# Altium project Chess Clock Front Display.PrjPcb
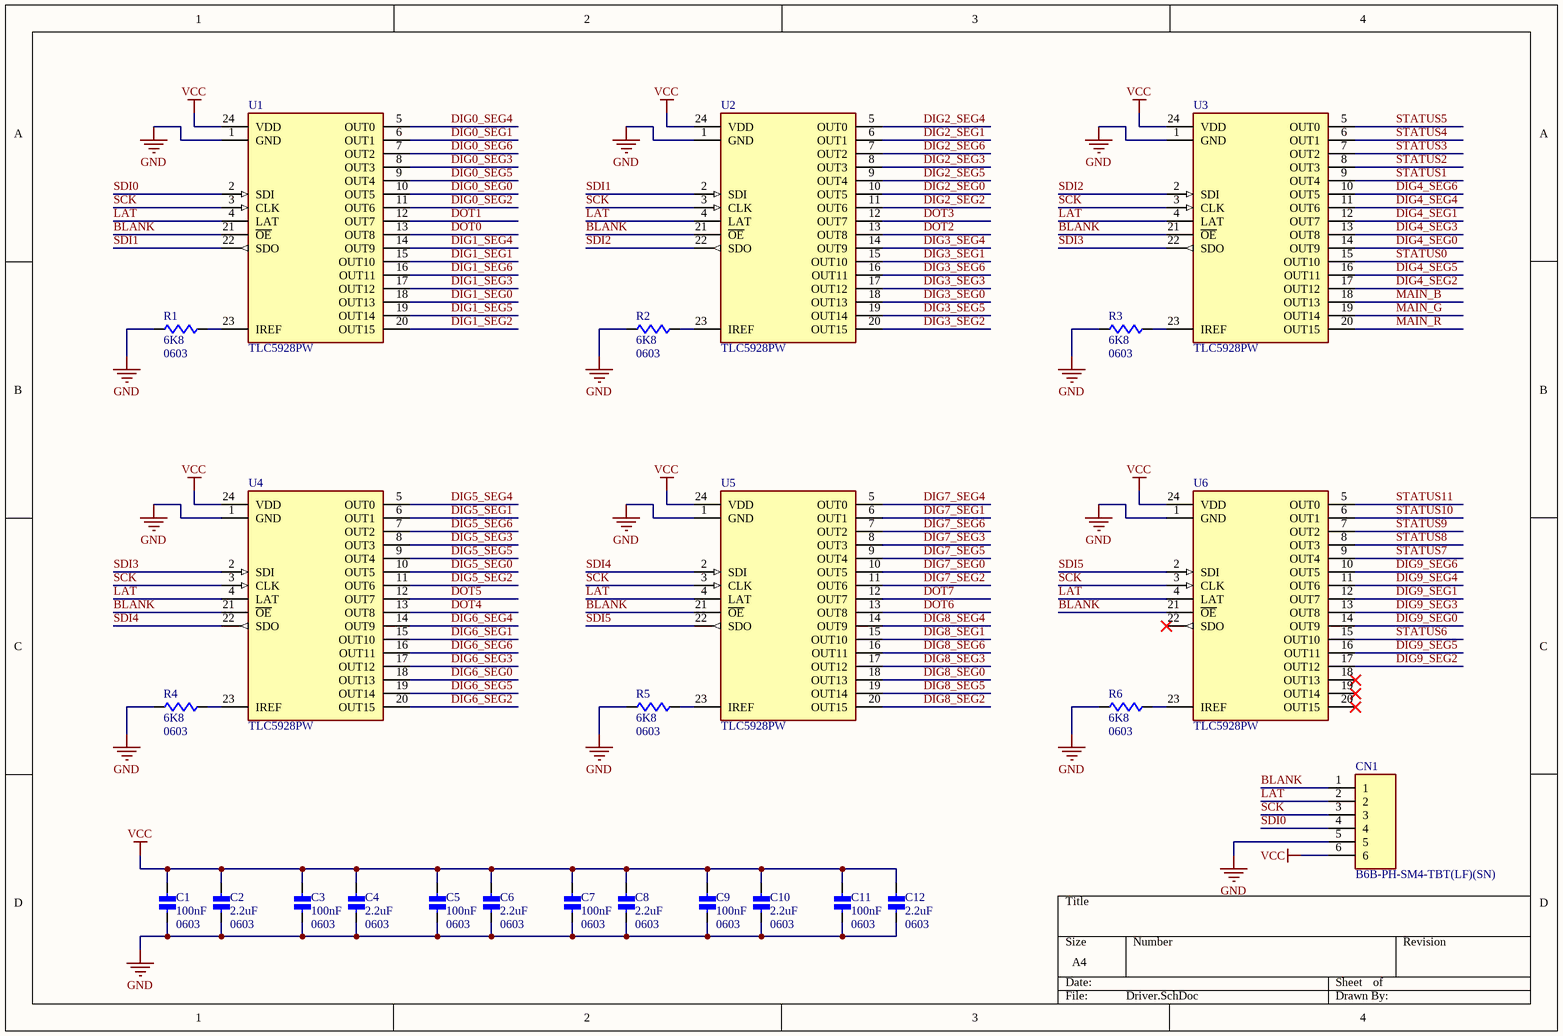
[diagram p0: Driver.SchDoc]
2 sheets, 118 parts. Net scope: global (net labels, ports and power ports of the same name join across sheets).
Board file: Chess Clock Front Display PCB.PcbDoc
Sheets:
  Driver.SchDoc
  Chess Clock Front Display SCH.SchDoc

## Sheet Driver.SchDoc
size A4

### Parts
C1  100nF  Package: 0603  [CAPC0603X08N]
C2  2.2uF  Package: 0603  [CAPC0603X08N]
C3  100nF  Package: 0603  [CAPC0603X08N]
C4  2.2uF  Package: 0603  [CAPC0603X08N]
C5  100nF  Package: 0603  [CAPC0603X08N]
C6  2.2uF  Package: 0603  [CAPC0603X08N]
C7  100nF  Package: 0603  [CAPC0603X08N]
C8  2.2uF  Package: 0603  [CAPC0603X08N]
C9  100nF  Package: 0603  [CAPC0603X08N]
C10  2.2uF  Package: 0603  [CAPC0603X08N]
C11  100nF  Package: 0603  [CAPC0603X08N]
C12  2.2uF  Package: 0603  [CAPC0603X08N]
CN1  B6B-PH-SM4-TBT(LF)(SN)  [B6B-PH-SM4-TBT(LF)(SN)]
R1  6K8  Package: 0603  [RESC0603X04N]
R2  6K8  Package: 0603  [RESC0603X04N]
R3  6K8  Package: 0603  [RESC0603X04N]
R4  6K8  Package: 0603  [RESC0603X04N]
R5  6K8  Package: 0603  [RESC0603X04N]
R6  6K8  Package: 0603  [RESC0603X04N]
U1  TLC5928PW  [TSOP65P640X120-24N]
U2  TLC5928PW  [TSOP65P640X120-24N]
U3  TLC5928PW  [TSOP65P640X120-24N]
U4  TLC5928PW  [TSOP65P640X120-24N]
U5  TLC5928PW  [TSOP65P640X120-24N]
U6  TLC5928PW  [TSOP65P640X120-24N]

### Nets
GND: C1.2 C2.2 C3.2 C4.2 C5.2 C6.2 C7.2 C8.2 C9.2 C10.2 C11.2 C12.2 CN1.5 R1.2 R2.2 R3.2 R4.2 R5.2 R6.2 U1.1(GND) U2.1(GND) U3.1(GND) U4.1(GND) U5.1(GND) U6.1(GND)
VCC: C1.1 C2.1 C3.1 C4.1 C5.1 C6.1 C7.1 C8.1 C9.1 C10.1 C11.1 C12.1 CN1.6 U1.24(VDD) U2.24(VDD) U3.24(VDD) U4.24(VDD) U5.24(VDD) U6.24(VDD)
BLANK: CN1.1 U1.21(~{OE}) U2.21(~{OE}) U3.21(~{OE}) U4.21(~{OE}) U5.21(~{OE}) U6.21(~{OE})
DIG0_SEG0: U1.10(OUT5)
DIG0_SEG1: U1.6(OUT1)
DIG0_SEG2: U1.11(OUT6)
DIG0_SEG3: U1.8(OUT3)
DIG0_SEG4: U1.5(OUT0)
DIG0_SEG5: U1.9(OUT4)
DIG0_SEG6: U1.7(OUT2)
DIG1_SEG0: U1.18(OUT13)
DIG1_SEG1: U1.15(OUT10)
DIG1_SEG2: U1.20(OUT15)
DIG1_SEG3: U1.17(OUT12)
DIG1_SEG4: U1.14(OUT9)
DIG1_SEG5: U1.19(OUT14)
DIG1_SEG6: U1.16(OUT11)
DIG2_SEG0: U2.10(OUT5)
DIG2_SEG1: U2.6(OUT1)
DIG2_SEG2: U2.11(OUT6)
DIG2_SEG3: U2.8(OUT3)
DIG2_SEG4: U2.5(OUT0)
DIG2_SEG5: U2.9(OUT4)
DIG2_SEG6: U2.7(OUT2)
DIG3_SEG0: U2.18(OUT13)
DIG3_SEG1: U2.15(OUT10)
DIG3_SEG2: U2.20(OUT15)
DIG3_SEG3: U2.17(OUT12)
DIG3_SEG4: U2.14(OUT9)
DIG3_SEG5: U2.19(OUT14)
DIG3_SEG6: U2.16(OUT11)
DIG4_SEG0: U3.14(OUT9)
DIG4_SEG1: U3.12(OUT7)
DIG4_SEG2: U3.17(OUT12)
DIG4_SEG3: U3.13(OUT8)
DIG4_SEG4: U3.11(OUT6)
DIG4_SEG5: U3.16(OUT11)
DIG4_SEG6: U3.10(OUT5)
DIG5_SEG0: U4.10(OUT5)
DIG5_SEG1: U4.6(OUT1)
DIG5_SEG2: U4.11(OUT6)
DIG5_SEG3: U4.8(OUT3)
DIG5_SEG4: U4.5(OUT0)
DIG5_SEG5: U4.9(OUT4)
DIG5_SEG6: U4.7(OUT2)
DIG6_SEG0: U4.18(OUT13)
DIG6_SEG1: U4.15(OUT10)
DIG6_SEG2: U4.20(OUT15)
DIG6_SEG3: U4.17(OUT12)
DIG6_SEG4: U4.14(OUT9)
DIG6_SEG5: U4.19(OUT14)
DIG6_SEG6: U4.16(OUT11)
DIG7_SEG0: U5.10(OUT5)
DIG7_SEG1: U5.6(OUT1)
DIG7_SEG2: U5.11(OUT6)
DIG7_SEG3: U5.8(OUT3)
DIG7_SEG4: U5.5(OUT0)
DIG7_SEG5: U5.9(OUT4)
DIG7_SEG6: U5.7(OUT2)
DIG8_SEG0: U5.18(OUT13)
DIG8_SEG1: U5.15(OUT10)
DIG8_SEG2: U5.20(OUT15)
DIG8_SEG3: U5.17(OUT12)
DIG8_SEG4: U5.14(OUT9)
DIG8_SEG5: U5.19(OUT14)
DIG8_SEG6: U5.16(OUT11)
DIG9_SEG0: U6.14(OUT9)
DIG9_SEG1: U6.12(OUT7)
DIG9_SEG2: U6.17(OUT12)
DIG9_SEG3: U6.13(OUT8)
DIG9_SEG4: U6.11(OUT6)
DIG9_SEG5: U6.16(OUT11)
DIG9_SEG6: U6.10(OUT5)
DOT0: U1.13(OUT8)
DOT1: U1.12(OUT7)
DOT2: U2.13(OUT8)
DOT3: U2.12(OUT7)
DOT4: U4.13(OUT8)
DOT5: U4.12(OUT7)
DOT6: U5.13(OUT8)
DOT7: U5.12(OUT7)
LAT: CN1.2 U1.4(LAT) U2.4(LAT) U3.4(LAT) U4.4(LAT) U5.4(LAT) U6.4(LAT)
MAIN_B: U3.18(OUT13)
MAIN_G: U3.19(OUT14)
MAIN_R: U3.20(OUT15)
SCK: CN1.3 U1.3(CLK) U2.3(CLK) U3.3(CLK) U4.3(CLK) U5.3(CLK) U6.3(CLK)
SDI0: CN1.4 U1.2(SDI)
SDI1: U1.22(SDO) U2.2(SDI)
SDI2: U2.22(SDO) U3.2(SDI)
SDI3: U3.22(SDO) U4.2(SDI)
SDI4: U4.22(SDO) U5.2(SDI)
SDI5: U5.22(SDO) U6.2(SDI)
STATUS0: U3.15(OUT10)
STATUS1: U3.9(OUT4)
STATUS2: U3.8(OUT3)
STATUS3: U3.7(OUT2)
STATUS4: U3.6(OUT1)
STATUS5: U3.5(OUT0)
STATUS6: U6.15(OUT10)
STATUS7: U6.9(OUT4)
STATUS8: U6.8(OUT3)
STATUS9: U6.7(OUT2)
STATUS10: U6.6(OUT1)
STATUS11: U6.5(OUT0)
NetR1_1: R1.1 U1.23(IREF)
NetR2_1: R2.1 U2.23(IREF)
NetR3_1: R3.1 U3.23(IREF)
NetR4_1: R4.1 U4.23(IREF)
NetR5_1: R5.1 U5.23(IREF)
NetR6_1: R6.1 U6.23(IREF)

Not connected (* = marked no-connect by the designer): U6 18(OUT13)* 19(OUT14)* 20(OUT15)* 22(SDO)*

### Library data of the parts
C1-C12 = GENERIC CAPC 0603: Generic 0603 Capacitors; Manufacturer: -; Manufacturer Part Number: -; Supplier 1: Digi-Key; Supplier Part Number 1: -; Supplier 2: LCSC; Supplier Part Number 2: -; Categories: Capacitors; Voltage - Rated: -; Temperature Coefficient: -; Tolerance: -
  C1 C3 C5 C7 C9 C11: Capacitance: 100nF
  C2 C4 C6 C8 C10 C12: Capacitance: 2.2uF
CN1 = B6B-PH-SM4-TBT(LF)(SN): Connector Header Surface Mount 6 position 0.079" (2.00mm)
R1-R6 = GENERIC RESC 0603: Generic 0603 1%/5% Resistor; Categories: Resistors; Manufacturer: -; Manufacturer Part Number: -; Supplier 1: Digi-Key; Supplier Part Number 1: -; Supplier 2: LCSC; Supplier Part Number 2: -; Temperature Coefficient: -; Tolerance: -; Power (Watts): -; Resistance: 6K8
U1-U6 = TLC5928PW: LED Driver IC 16 Output Linear Shift Register  Dimming 35mA 24-TSSOP; Manufacturer: Texas Instruments; Categories: LED Drivers; Manufacturer Part Number: TLC5928PW; Package: 24-TSSOP; Supplier 1: Digi-Key; Supplier 2: LCSC; Supplier Part Number 1: 296-23819-5-ND; Supplier Part Number 2: C1554293

## Sheet Chess Clock Front Display SCH.SchDoc
size A3
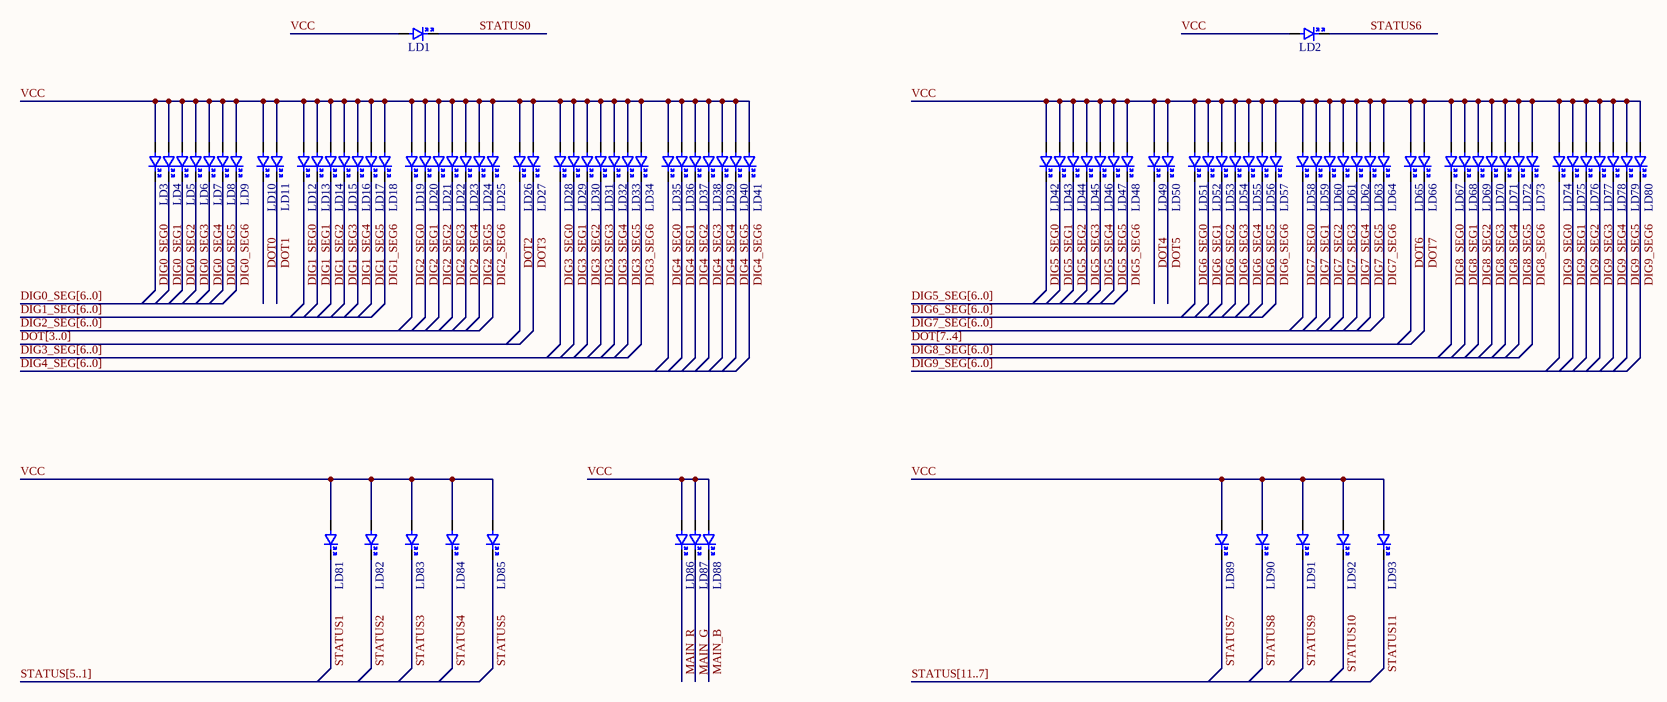
[diagram p1: Chess Clock Front Display SCH.SchDoc]

### Parts
LD1  LED 0603  [LED 0603]  (value not drawn)
LD2  LED 0603  [LED 0603]  (value not drawn)
LD3  LED 0603  [LED 0603]  (value not drawn)
LD4  LED 0603  [LED 0603]  (value not drawn)
LD5  LED 0603  [LED 0603]  (value not drawn)
LD6  LED 0603  [LED 0603]  (value not drawn)
LD7  LED 0603  [LED 0603]  (value not drawn)
LD8  LED 0603  [LED 0603]  (value not drawn)
LD9  LED 0603  [LED 0603]  (value not drawn)
LD10  LED 0603  [LED 0603]  (value not drawn)
LD11  LED 0603  [LED 0603]  (value not drawn)
LD12  LED 0603  [LED 0603]  (value not drawn)
LD13  LED 0603  [LED 0603]  (value not drawn)
LD14  LED 0603  [LED 0603]  (value not drawn)
LD15  LED 0603  [LED 0603]  (value not drawn)
LD16  LED 0603  [LED 0603]  (value not drawn)
LD17  LED 0603  [LED 0603]  (value not drawn)
LD18  LED 0603  [LED 0603]  (value not drawn)
LD19  LED 0603  [LED 0603]  (value not drawn)
LD20  LED 0603  [LED 0603]  (value not drawn)
LD21  LED 0603  [LED 0603]  (value not drawn)
LD22  LED 0603  [LED 0603]  (value not drawn)
LD23  LED 0603  [LED 0603]  (value not drawn)
LD24  LED 0603  [LED 0603]  (value not drawn)
LD25  LED 0603  [LED 0603]  (value not drawn)
LD26  LED 0603  [LED 0603]  (value not drawn)
LD27  LED 0603  [LED 0603]  (value not drawn)
LD28  LED 0603  [LED 0603]  (value not drawn)
LD29  LED 0603  [LED 0603]  (value not drawn)
LD30  LED 0603  [LED 0603]  (value not drawn)
LD31  LED 0603  [LED 0603]  (value not drawn)
LD32  LED 0603  [LED 0603]  (value not drawn)
LD33  LED 0603  [LED 0603]  (value not drawn)
LD34  LED 0603  [LED 0603]  (value not drawn)
LD35  LED 0603  [LED 0603]  (value not drawn)
LD36  LED 0603  [LED 0603]  (value not drawn)
LD37  LED 0603  [LED 0603]  (value not drawn)
LD38  LED 0603  [LED 0603]  (value not drawn)
LD39  LED 0603  [LED 0603]  (value not drawn)
LD40  LED 0603  [LED 0603]  (value not drawn)
LD41  LED 0603  [LED 0603]  (value not drawn)
LD42  LED 0603  [LED 0603]  (value not drawn)
LD43  LED 0603  [LED 0603]  (value not drawn)
LD44  LED 0603  [LED 0603]  (value not drawn)
LD45  LED 0603  [LED 0603]  (value not drawn)
LD46  LED 0603  [LED 0603]  (value not drawn)
LD47  LED 0603  [LED 0603]  (value not drawn)
LD48  LED 0603  [LED 0603]  (value not drawn)
LD49  LED 0603  [LED 0603]  (value not drawn)
LD50  LED 0603  [LED 0603]  (value not drawn)
LD51  LED 0603  [LED 0603]  (value not drawn)
LD52  LED 0603  [LED 0603]  (value not drawn)
LD53  LED 0603  [LED 0603]  (value not drawn)
LD54  LED 0603  [LED 0603]  (value not drawn)
LD55  LED 0603  [LED 0603]  (value not drawn)
LD56  LED 0603  [LED 0603]  (value not drawn)
LD57  LED 0603  [LED 0603]  (value not drawn)
LD58  LED 0603  [LED 0603]  (value not drawn)
LD59  LED 0603  [LED 0603]  (value not drawn)
LD60  LED 0603  [LED 0603]  (value not drawn)
LD61  LED 0603  [LED 0603]  (value not drawn)
LD62  LED 0603  [LED 0603]  (value not drawn)
LD63  LED 0603  [LED 0603]  (value not drawn)
LD64  LED 0603  [LED 0603]  (value not drawn)
LD65  LED 0603  [LED 0603]  (value not drawn)
LD66  LED 0603  [LED 0603]  (value not drawn)
LD67  LED 0603  [LED 0603]  (value not drawn)
LD68  LED 0603  [LED 0603]  (value not drawn)
LD69  LED 0603  [LED 0603]  (value not drawn)
LD70  LED 0603  [LED 0603]  (value not drawn)
LD71  LED 0603  [LED 0603]  (value not drawn)
LD72  LED 0603  [LED 0603]  (value not drawn)
LD73  LED 0603  [LED 0603]  (value not drawn)
LD74  LED 0603  [LED 0603]  (value not drawn)
LD75  LED 0603  [LED 0603]  (value not drawn)
LD76  LED 0603  [LED 0603]  (value not drawn)
LD77  LED 0603  [LED 0603]  (value not drawn)
LD78  LED 0603  [LED 0603]  (value not drawn)
LD79  LED 0603  [LED 0603]  (value not drawn)
LD80  LED 0603  [LED 0603]  (value not drawn)
LD81  LED 0603  [LED 0603]  (value not drawn)
LD82  LED 0603  [LED 0603]  (value not drawn)
LD83  LED 0603  [LED 0603]  (value not drawn)
LD84  LED 0603  [LED 0603]  (value not drawn)
LD85  LED 0603  [LED 0603]  (value not drawn)
LD86  LED 0603  [LED 0603]  (value not drawn)
LD87  LED 0603  [LED 0603]  (value not drawn)
LD88  LED 0603  [LED 0603]  (value not drawn)
LD89  LED 0603  [LED 0603]  (value not drawn)
LD90  LED 0603  [LED 0603]  (value not drawn)
LD91  LED 0603  [LED 0603]  (value not drawn)
LD92  LED 0603  [LED 0603]  (value not drawn)
LD93  LED 0603  [LED 0603]  (value not drawn)

### Nets
VCC: LD1.1 LD2.1 LD3.1 LD4.1 LD5.1 LD6.1 LD7.1 LD8.1 LD9.1 LD10.1 LD11.1 LD12.1 LD13.1 LD14.1 LD15.1 LD16.1 LD17.1 LD18.1 LD19.1 LD20.1 LD21.1 LD22.1 LD23.1 LD24.1 LD25.1 LD26.1 LD27.1 LD28.1 LD29.1 LD30.1 LD31.1 LD32.1 LD33.1 LD34.1 LD35.1 LD36.1 LD37.1 LD38.1 LD39.1 LD40.1 LD41.1 LD42.1 LD43.1 LD44.1 LD45.1 LD46.1 LD47.1 LD48.1 LD49.1 LD50.1 LD51.1 LD52.1 LD53.1 LD54.1 LD55.1 LD56.1 LD57.1 LD58.1 LD59.1 LD60.1 LD61.1 LD62.1 LD63.1 LD64.1 LD65.1 LD66.1 LD67.1 LD68.1 LD69.1 LD70.1 LD71.1 LD72.1 LD73.1 LD74.1 LD75.1 LD76.1 LD77.1 LD78.1 LD79.1 LD80.1 LD81.1 LD82.1 LD83.1 LD84.1 LD85.1 LD86.1 LD87.1 LD88.1 LD89.1 LD90.1 LD91.1 LD92.1 LD93.1
DIG0_SEG0: LD3.2
DIG0_SEG1: LD4.2
DIG0_SEG2: LD5.2
DIG0_SEG3: LD6.2
DIG0_SEG4: LD7.2
DIG0_SEG5: LD8.2
DIG0_SEG6: LD9.2
DIG1_SEG0: LD12.2
DIG1_SEG1: LD13.2
DIG1_SEG2: LD14.2
DIG1_SEG3: LD15.2
DIG1_SEG4: LD16.2
DIG1_SEG5: LD17.2
DIG1_SEG6: LD18.2
DIG2_SEG0: LD19.2
DIG2_SEG1: LD20.2
DIG2_SEG2: LD21.2
DIG2_SEG3: LD22.2
DIG2_SEG4: LD23.2
DIG2_SEG5: LD24.2
DIG2_SEG6: LD25.2
DIG3_SEG0: LD28.2
DIG3_SEG1: LD29.2
DIG3_SEG2: LD30.2
DIG3_SEG3: LD31.2
DIG3_SEG4: LD32.2
DIG3_SEG5: LD33.2
DIG3_SEG6: LD34.2
DIG4_SEG0: LD35.2
DIG4_SEG1: LD36.2
DIG4_SEG2: LD37.2
DIG4_SEG3: LD38.2
DIG4_SEG4: LD39.2
DIG4_SEG5: LD40.2
DIG4_SEG6: LD41.2
DIG5_SEG0: LD42.2
DIG5_SEG1: LD43.2
DIG5_SEG2: LD44.2
DIG5_SEG3: LD45.2
DIG5_SEG4: LD46.2
DIG5_SEG5: LD47.2
DIG5_SEG6: LD48.2
DIG6_SEG0: LD51.2
DIG6_SEG1: LD52.2
DIG6_SEG2: LD53.2
DIG6_SEG3: LD54.2
DIG6_SEG4: LD55.2
DIG6_SEG5: LD56.2
DIG6_SEG6: LD57.2
DIG7_SEG0: LD58.2
DIG7_SEG1: LD59.2
DIG7_SEG2: LD60.2
DIG7_SEG3: LD61.2
DIG7_SEG4: LD62.2
DIG7_SEG5: LD63.2
DIG7_SEG6: LD64.2
DIG8_SEG0: LD67.2
DIG8_SEG1: LD68.2
DIG8_SEG2: LD69.2
DIG8_SEG3: LD70.2
DIG8_SEG4: LD71.2
DIG8_SEG5: LD72.2
DIG8_SEG6: LD73.2
DIG9_SEG0: LD74.2
DIG9_SEG1: LD75.2
DIG9_SEG2: LD76.2
DIG9_SEG3: LD77.2
DIG9_SEG4: LD78.2
DIG9_SEG5: LD79.2
DIG9_SEG6: LD80.2
DOT0: LD10.2
DOT1: LD11.2
DOT2: LD26.2
DOT3: LD27.2
DOT4: LD49.2
DOT5: LD50.2
DOT6: LD65.2
DOT7: LD66.2
MAIN_B: LD88.2
MAIN_G: LD87.2
MAIN_R: LD86.2
STATUS0: LD1.2
STATUS1: LD81.2
STATUS2: LD82.2
STATUS3: LD83.2
STATUS4: LD84.2
STATUS5: LD85.2
STATUS6: LD2.2
STATUS7: LD89.2
STATUS8: LD90.2
STATUS9: LD91.2
STATUS10: LD92.2
STATUS11: LD93.2

### Buses and harness runs
bus DIG0_SEG[6..0]
bus DIG1_SEG[6..0]
bus DIG2_SEG[6..0]
bus DIG3_SEG[6..0]
bus DIG4_SEG[6..0]
bus DIG5_SEG[6..0]
bus DIG6_SEG[6..0]
bus DIG7_SEG[6..0]
bus DIG8_SEG[6..0]
bus DIG9_SEG[6..0]
bus DOT[3..0]
bus DOT[7..4]
bus STATUS[5..1]
bus STATUS[11..7]

### Library data of the parts
LD1-LD93 = LED 0603: Categories: LED; Manufacturer: -; Manufacturer Part Number: -; Package: 0603; Supplier 1: Digi-Key; Supplier 2: LCSC; Supplier Part Number 1: -; Supplier Part Number 2: -

## Nets that join several sheets
VCC: Driver (19 pins), Chess Clock Front Display SCH (93 pins)
DIG0_SEG0: Driver (U1.10), Chess Clock Front Display SCH (LD3.2)
DIG0_SEG1: Driver (U1.6), Chess Clock Front Display SCH (LD4.2)
DIG0_SEG2: Driver (U1.11), Chess Clock Front Display SCH (LD5.2)
DIG0_SEG3: Driver (U1.8), Chess Clock Front Display SCH (LD6.2)
DIG0_SEG4: Driver (U1.5), Chess Clock Front Display SCH (LD7.2)
DIG0_SEG5: Driver (U1.9), Chess Clock Front Display SCH (LD8.2)
DIG0_SEG6: Driver (U1.7), Chess Clock Front Display SCH (LD9.2)
DIG1_SEG0: Driver (U1.18), Chess Clock Front Display SCH (LD12.2)
DIG1_SEG1: Driver (U1.15), Chess Clock Front Display SCH (LD13.2)
DIG1_SEG2: Driver (U1.20), Chess Clock Front Display SCH (LD14.2)
DIG1_SEG3: Driver (U1.17), Chess Clock Front Display SCH (LD15.2)
DIG1_SEG4: Driver (U1.14), Chess Clock Front Display SCH (LD16.2)
DIG1_SEG5: Driver (U1.19), Chess Clock Front Display SCH (LD17.2)
DIG1_SEG6: Driver (U1.16), Chess Clock Front Display SCH (LD18.2)
DIG2_SEG0: Driver (U2.10), Chess Clock Front Display SCH (LD19.2)
DIG2_SEG1: Driver (U2.6), Chess Clock Front Display SCH (LD20.2)
DIG2_SEG2: Driver (U2.11), Chess Clock Front Display SCH (LD21.2)
DIG2_SEG3: Driver (U2.8), Chess Clock Front Display SCH (LD22.2)
DIG2_SEG4: Driver (U2.5), Chess Clock Front Display SCH (LD23.2)
DIG2_SEG5: Driver (U2.9), Chess Clock Front Display SCH (LD24.2)
DIG2_SEG6: Driver (U2.7), Chess Clock Front Display SCH (LD25.2)
DIG3_SEG0: Driver (U2.18), Chess Clock Front Display SCH (LD28.2)
DIG3_SEG1: Driver (U2.15), Chess Clock Front Display SCH (LD29.2)
DIG3_SEG2: Driver (U2.20), Chess Clock Front Display SCH (LD30.2)
DIG3_SEG3: Driver (U2.17), Chess Clock Front Display SCH (LD31.2)
DIG3_SEG4: Driver (U2.14), Chess Clock Front Display SCH (LD32.2)
DIG3_SEG5: Driver (U2.19), Chess Clock Front Display SCH (LD33.2)
DIG3_SEG6: Driver (U2.16), Chess Clock Front Display SCH (LD34.2)
DIG4_SEG0: Driver (U3.14), Chess Clock Front Display SCH (LD35.2)
DIG4_SEG1: Driver (U3.12), Chess Clock Front Display SCH (LD36.2)
DIG4_SEG2: Driver (U3.17), Chess Clock Front Display SCH (LD37.2)
DIG4_SEG3: Driver (U3.13), Chess Clock Front Display SCH (LD38.2)
DIG4_SEG4: Driver (U3.11), Chess Clock Front Display SCH (LD39.2)
DIG4_SEG5: Driver (U3.16), Chess Clock Front Display SCH (LD40.2)
DIG4_SEG6: Driver (U3.10), Chess Clock Front Display SCH (LD41.2)
DIG5_SEG0: Driver (U4.10), Chess Clock Front Display SCH (LD42.2)
DIG5_SEG1: Driver (U4.6), Chess Clock Front Display SCH (LD43.2)
DIG5_SEG2: Driver (U4.11), Chess Clock Front Display SCH (LD44.2)
DIG5_SEG3: Driver (U4.8), Chess Clock Front Display SCH (LD45.2)
DIG5_SEG4: Driver (U4.5), Chess Clock Front Display SCH (LD46.2)
DIG5_SEG5: Driver (U4.9), Chess Clock Front Display SCH (LD47.2)
DIG5_SEG6: Driver (U4.7), Chess Clock Front Display SCH (LD48.2)
DIG6_SEG0: Driver (U4.18), Chess Clock Front Display SCH (LD51.2)
DIG6_SEG1: Driver (U4.15), Chess Clock Front Display SCH (LD52.2)
DIG6_SEG2: Driver (U4.20), Chess Clock Front Display SCH (LD53.2)
DIG6_SEG3: Driver (U4.17), Chess Clock Front Display SCH (LD54.2)
DIG6_SEG4: Driver (U4.14), Chess Clock Front Display SCH (LD55.2)
DIG6_SEG5: Driver (U4.19), Chess Clock Front Display SCH (LD56.2)
DIG6_SEG6: Driver (U4.16), Chess Clock Front Display SCH (LD57.2)
DIG7_SEG0: Driver (U5.10), Chess Clock Front Display SCH (LD58.2)
DIG7_SEG1: Driver (U5.6), Chess Clock Front Display SCH (LD59.2)
DIG7_SEG2: Driver (U5.11), Chess Clock Front Display SCH (LD60.2)
DIG7_SEG3: Driver (U5.8), Chess Clock Front Display SCH (LD61.2)
DIG7_SEG4: Driver (U5.5), Chess Clock Front Display SCH (LD62.2)
DIG7_SEG5: Driver (U5.9), Chess Clock Front Display SCH (LD63.2)
DIG7_SEG6: Driver (U5.7), Chess Clock Front Display SCH (LD64.2)
DIG8_SEG0: Driver (U5.18), Chess Clock Front Display SCH (LD67.2)
DIG8_SEG1: Driver (U5.15), Chess Clock Front Display SCH (LD68.2)
DIG8_SEG2: Driver (U5.20), Chess Clock Front Display SCH (LD69.2)
DIG8_SEG3: Driver (U5.17), Chess Clock Front Display SCH (LD70.2)
DIG8_SEG4: Driver (U5.14), Chess Clock Front Display SCH (LD71.2)
DIG8_SEG5: Driver (U5.19), Chess Clock Front Display SCH (LD72.2)
DIG8_SEG6: Driver (U5.16), Chess Clock Front Display SCH (LD73.2)
DIG9_SEG0: Driver (U6.14), Chess Clock Front Display SCH (LD74.2)
DIG9_SEG1: Driver (U6.12), Chess Clock Front Display SCH (LD75.2)
DIG9_SEG2: Driver (U6.17), Chess Clock Front Display SCH (LD76.2)
DIG9_SEG3: Driver (U6.13), Chess Clock Front Display SCH (LD77.2)
DIG9_SEG4: Driver (U6.11), Chess Clock Front Display SCH (LD78.2)
DIG9_SEG5: Driver (U6.16), Chess Clock Front Display SCH (LD79.2)
DIG9_SEG6: Driver (U6.10), Chess Clock Front Display SCH (LD80.2)
DOT0: Driver (U1.13), Chess Clock Front Display SCH (LD10.2)
DOT1: Driver (U1.12), Chess Clock Front Display SCH (LD11.2)
DOT2: Driver (U2.13), Chess Clock Front Display SCH (LD26.2)
DOT3: Driver (U2.12), Chess Clock Front Display SCH (LD27.2)
DOT4: Driver (U4.13), Chess Clock Front Display SCH (LD49.2)
DOT5: Driver (U4.12), Chess Clock Front Display SCH (LD50.2)
DOT6: Driver (U5.13), Chess Clock Front Display SCH (LD65.2)
DOT7: Driver (U5.12), Chess Clock Front Display SCH (LD66.2)
MAIN_B: Driver (U3.18), Chess Clock Front Display SCH (LD88.2)
MAIN_G: Driver (U3.19), Chess Clock Front Display SCH (LD87.2)
MAIN_R: Driver (U3.20), Chess Clock Front Display SCH (LD86.2)
STATUS0: Driver (U3.15), Chess Clock Front Display SCH (LD1.2)
STATUS1: Driver (U3.9), Chess Clock Front Display SCH (LD81.2)
STATUS2: Driver (U3.8), Chess Clock Front Display SCH (LD82.2)
STATUS3: Driver (U3.7), Chess Clock Front Display SCH (LD83.2)
STATUS4: Driver (U3.6), Chess Clock Front Display SCH (LD84.2)
STATUS5: Driver (U3.5), Chess Clock Front Display SCH (LD85.2)
STATUS6: Driver (U6.15), Chess Clock Front Display SCH (LD2.2)
STATUS7: Driver (U6.9), Chess Clock Front Display SCH (LD89.2)
STATUS8: Driver (U6.8), Chess Clock Front Display SCH (LD90.2)
STATUS9: Driver (U6.7), Chess Clock Front Display SCH (LD91.2)
STATUS10: Driver (U6.6), Chess Clock Front Display SCH (LD92.2)
STATUS11: Driver (U6.5), Chess Clock Front Display SCH (LD93.2)